# Altium schematic sheet 1.1.5_Interface_board_Servos.SchDoc
size A4; DocumentNumber: 7; SheetNumber: 7; SheetTotal: 14
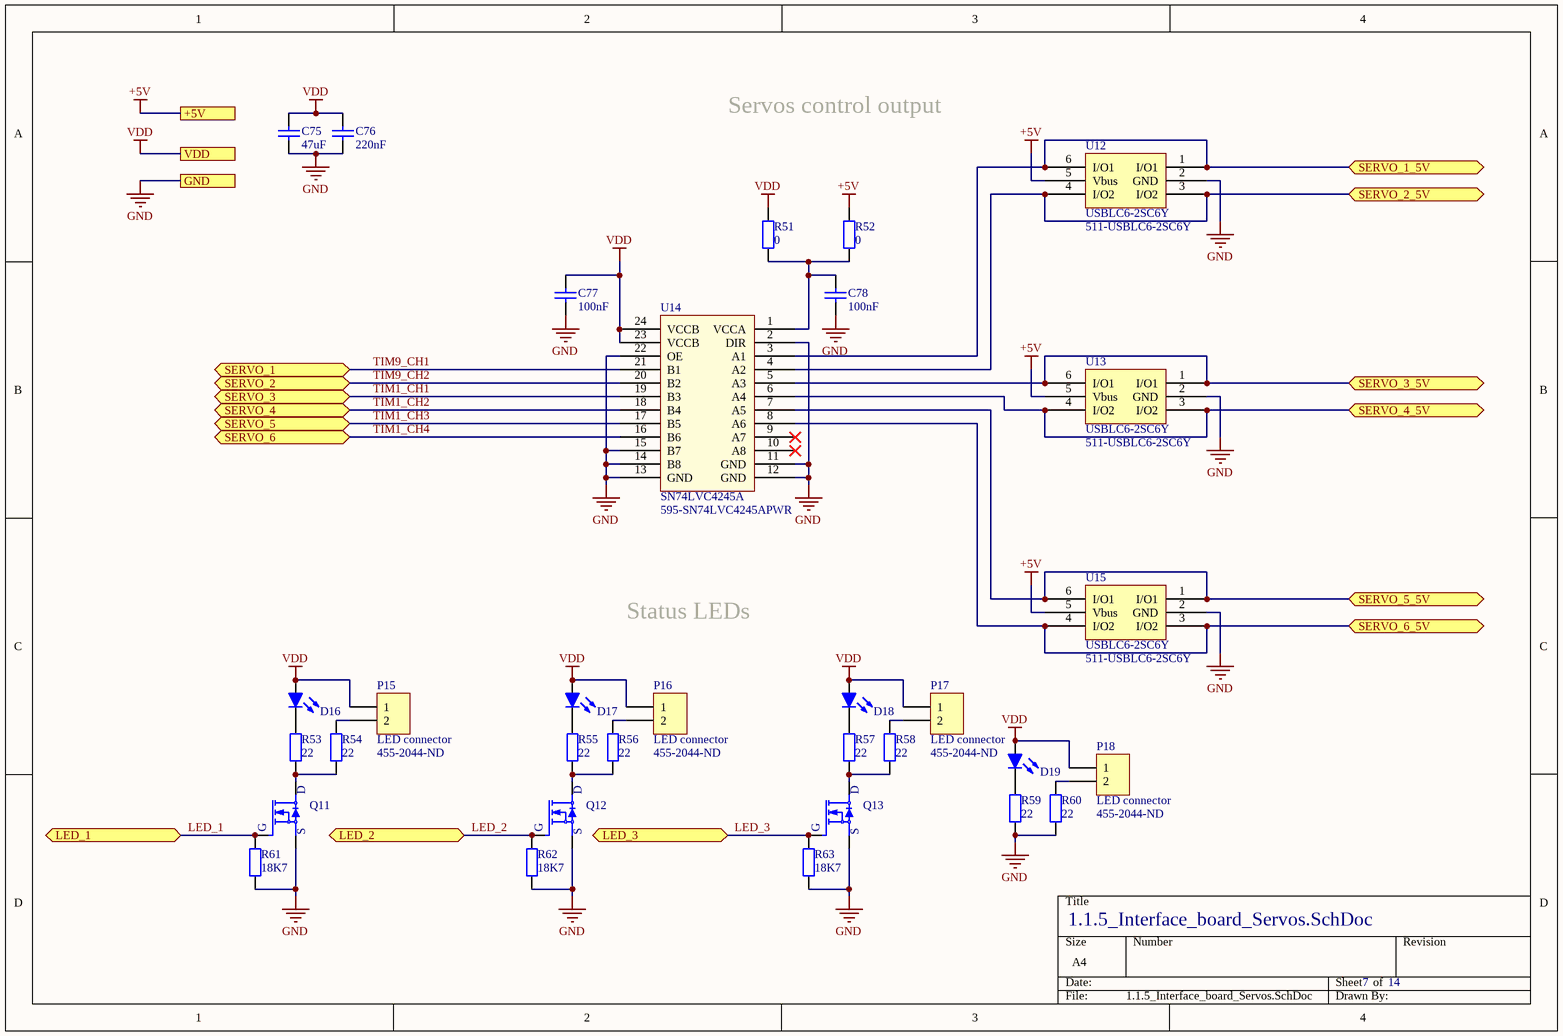
[diagram p0: 1.1.5_Interface_board_Servos.SchDoc]

## Parts
C75  47uF  [CAP1206W]
C76  220nF  [CAP0603R]
C77  100nF  [CAP0603R]
C78  100nF  [CAP0603R]
D16  LED  [WL-SMCW]  (value not drawn)
D17  LED  [WL-SMCW]  (value not drawn)
D18  LED  [WL-SMCW]  (value not drawn)
D19  LED  [WL-SMCW]  (value not drawn)
P15  LED connector  Supplier Part Number 1: 455-2044-ND  [CON_JST_XA_ S02B-XASS-1]
P16  LED connector  Supplier Part Number 1: 455-2044-ND  [CON_JST_XA_ S02B-XASS-1]
P17  LED connector  Supplier Part Number 1: 455-2044-ND  [CON_JST_XA_ S02B-XASS-1]
P18  LED connector  Supplier Part Number 1: 455-2044-ND  [CON_JST_XA_ S02B-XASS-1]
Q11  MOSFET_N  [SOT-323-3]  (value not drawn)
Q12  MOSFET_N  [SOT-323-3]  (value not drawn)
Q13  MOSFET_N  [SOT-323-3]  (value not drawn)
R51  0  [0603]
R52  0  [0603]
R53  22  [0603]
R54  22  [0603]
R55  22  [0603]
R56  22  [0603]
R57  22  [0603]
R58  22  [0603]
R59  22  [0603]
R60  22  [0603]
R61  18K7  [0603]
R62  18K7  [0603]
R63  18K7  [0603]
U12  USBLC6-2SC6Y  Supplier Part Number 1: 511-USBLC6-2SC6Y  [SOT23-6L]
U13  USBLC6-2SC6Y  Supplier Part Number 1: 511-USBLC6-2SC6Y  [SOT23-6L]
U14  SN74LVC4245A  Supplier Part Number 1: 595-SN74LVC4245APWR  [TSSOP 24]
U15  USBLC6-2SC6Y  Supplier Part Number 1: 511-USBLC6-2SC6Y  [SOT23-6L]

## Ports
+5V, GND, LED_1 (bidir), LED_2 (bidir), LED_3 (bidir), SERVO_1 (bidir), SERVO_1_5V (bidir), SERVO_2 (bidir), SERVO_2_5V (bidir), SERVO_3 (bidir), SERVO_3_5V (bidir), SERVO_4 (bidir), SERVO_4_5V (bidir), SERVO_5 (bidir), SERVO_5_5V (bidir), SERVO_6 (bidir), SERVO_6_5V (bidir), VDD

## Nets
+5V: R52.2 U12.5(Vbus) U13.5(Vbus) U15.5(Vbus) ; port +5V
GND: C75.1 C76.1 C77.1 C78.1 Q11.2(S) Q12.2(S) Q13.2(S) R59.1 R60.1 R61.1 R62.1 R63.1 U12.2(GND) U13.2(GND) U14.2(DIR) U14.11(GND) U14.12(GND) U14.13(GND) U14.14(B8) U14.15(B7) U14.22(OE) U15.2(GND) ; port GND
VDD: C75.2 C76.2 C77.2 D16.A D17.A D18.A D19.A P15.1 P16.1 P17.1 P18.1 R51.2 U14.23(VCCB) U14.24(VCCB) ; port VDD
LED_1: Q11.1(G) R61.2 ; port LED_1
LED_2: Q12.1(G) R62.2 ; port LED_2
LED_3: Q13.1(G) R63.2 ; port LED_3
SERVO_1_5V: U12.1(I/O1) U12.6(I/O1) U14.3(A1) ; port SERVO_1_5V
SERVO_2_5V: U12.3(I/O2) U12.4(I/O2) U14.4(A2) ; port SERVO_2_5V
SERVO_3_5V: U13.1(I/O1) U13.6(I/O1) U14.5(A3) ; port SERVO_3_5V
SERVO_4_5V: U13.3(I/O2) U13.4(I/O2) U14.6(A4) ; port SERVO_4_5V
SERVO_5_5V: U14.7(A5) U15.1(I/O1) U15.6(I/O1) ; port SERVO_5_5V
SERVO_6_5V: U14.8(A6) U15.3(I/O2) U15.4(I/O2) ; port SERVO_6_5V
TIM1_CH1: U14.19(B3) ; port SERVO_3
TIM1_CH2: U14.18(B4) ; port SERVO_4
TIM1_CH3: U14.17(B5) ; port SERVO_5
TIM1_CH4: U14.16(B6) ; port SERVO_6
TIM9_CH1: U14.21(B1) ; port SERVO_1
TIM9_CH2: U14.20(B2) ; port SERVO_2
NetC78_2: C78.2 R51.1 R52.1 U14.1(VCCA)
NetD16_C: D16.C R53.2
NetD17_C: D17.C R55.2
NetD18_C: D18.C R57.2
NetD19_C: D19.C R59.2
NetP15_2: P15.2 R54.2
NetP16_2: P16.2 R56.2
NetP17_2: P17.2 R58.2
NetP18_2: P18.2 R60.2
NetQ11_3: Q11.3(D) R53.1 R54.1
NetQ12_3: Q12.3(D) R55.1 R56.1
NetQ13_3: Q13.3(D) R57.1 R58.1

Not connected (* = marked no-connect by the designer): U14 9(A7)* 10(A8)*

## Notes on the sheet
- Servos control output
- Status LEDs

## Library data of the parts
C75 = C_47uF_25v_1206: Capacitor; Supplier 1: Mouser; Supplier Part Number 1: 810-C3216X5R1E476M
C76 = C_220nF: Capacitor; Supplier 1: Mouser; Supplier Part Number 1: 81-GCG188R91H224KA1D
C77 C78 = C_100nF: Capacitor; Supplier 1: Mouser; Supplier Part Number 1: 81-GCG188R91H104KA1D
D16-D19 = LED_SMD_GREEN_0603: Standard LEDs - SMD WL-SMCW Waterclr 0603 Green; Supplier 1: Mouser; Supplier Part Number 1: 710-150060GS75000
P15-P18 = Header 2p JST XA 3A right angle: Supplier 1: Digi-Key
Q11-Q13 = MOSFET_N_ 20V_1.4A: MOSFET N-Ch 20V 1.4A SOT-323-3; Supplier 1: Mouser; Supplier Part Number 1: 726-SP000917562
R51 R52 = R_0603_0Ohm_jumper: 0 Ohm; Supplier 1: Mouser; Supplier Part Number 1: 667-ERJ-3GEY0R00V
R53-R60 = R_0603_025W_22Ohm: 0.25W 22Ohm; LatestRevisionDate: 17-Jul-2002; LatestRevisionNote: Re-released for DXP Platform.; PackageReference: AXIAL-0.4; PackageDescription: Axial Device, Thru-Hole; 2 Leads; 0.4 in Pin Spacing; Supplier 1: Mouser; Supplier Part Number 1: 667-ERJ-PA3J220V
R61-R63 = R_0603_01W_18K7: 0.1W 18K7; Supplier 1: Mouser; Supplier Part Number 1: 667-ERJ-3EKF1872V
U12 U13 U15 = USBLC6-2SC6Y: ESD Suppressors; Supplier 1: Mouser
U14 = SN74LVC4245A: Level shifter 8; Supplier 1: Mouser